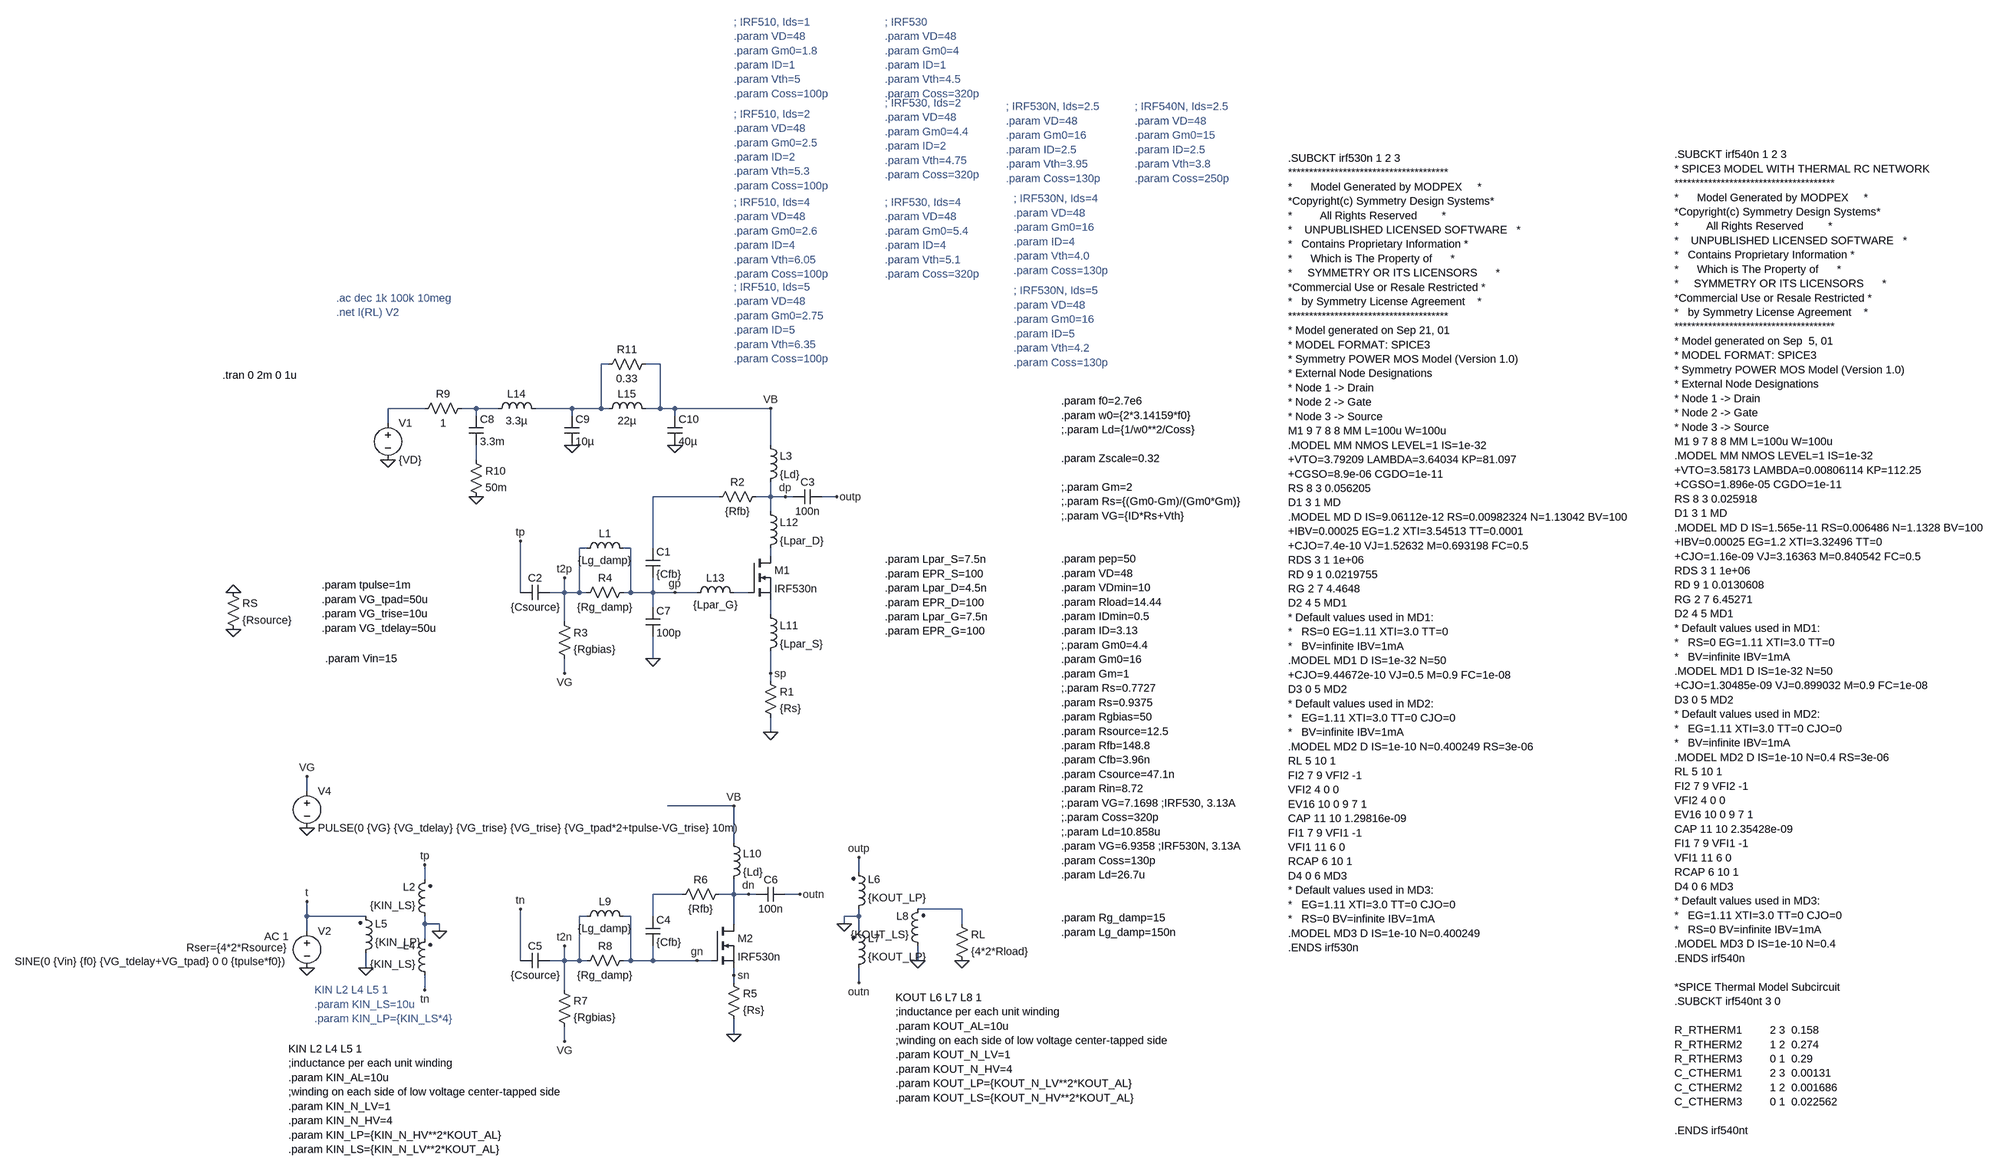
[diagram p0: schematic RFPA_tran_param.asc]
RFPA_tran_param.asc, the LTspice schematic file:
Version 4
SHEET 1 3240 1172
WIRE -80 -528 -96 -528
WIRE 32 -528 0 -528
WIRE -480 -432 -560 -432
WIRE -368 -432 -400 -432
WIRE -320 -432 -368 -432
WIRE -160 -432 -240 -432
WIRE -96 -432 -96 -528
WIRE -96 -432 -160 -432
WIRE -80 -432 -96 -432
WIRE 32 -432 32 -528
WIRE 32 -432 0 -432
WIRE 64 -432 32 -432
WIRE 272 -432 64 -432
WIRE -368 -416 -368 -432
WIRE -160 -416 -160 -432
WIRE 64 -416 64 -432
WIRE -560 -400 -560 -432
WIRE 272 -352 272 -432
WIRE -368 -320 -368 -352
WIRE 160 -240 16 -240
WIRE 272 -240 272 -272
WIRE 272 -240 240 -240
WIRE 304 -240 272 -240
WIRE 320 -240 304 -240
WIRE 416 -240 384 -240
WIRE 272 -208 272 -240
WIRE -128 -128 -144 -128
WIRE -32 -128 -48 -128
WIRE 16 -128 16 -240
WIRE 272 -112 272 -128
WIRE -272 -32 -272 -144
WIRE -176 -32 -176 -64
WIRE -176 -32 -208 -32
WIRE -144 -32 -144 -128
WIRE -144 -32 -176 -32
WIRE -128 -32 -144 -32
WIRE -32 -32 -32 -128
WIRE -32 -32 -48 -32
WIRE 16 -32 16 -64
WIRE 16 -32 -32 -32
WIRE 64 -32 16 -32
WIRE 112 -32 64 -32
WIRE 224 -32 192 -32
WIRE 16 0 16 -32
WIRE 272 16 272 -16
WIRE -176 32 -176 -32
WIRE 16 112 16 64
WIRE -176 144 -176 112
WIRE 272 144 272 96
WIRE 272 160 272 144
WIRE 272 272 272 240
WIRE -736 400 -736 368
WIRE 192 432 48 432
WIRE 192 512 192 432
WIRE 464 576 464 544
WIRE -480 592 -480 560
WIRE 80 624 16 624
WIRE 192 624 192 592
WIRE 192 624 160 624
WIRE 224 624 192 624
WIRE 240 624 224 624
WIRE 336 624 304 624
WIRE 688 656 592 656
WIRE -736 672 -736 640
WIRE -608 672 -736 672
WIRE -128 672 -144 672
WIRE -32 672 -48 672
WIRE 16 672 16 624
WIRE 464 672 464 656
WIRE 464 672 432 672
WIRE -480 688 -480 672
WIRE -448 688 -480 688
WIRE 192 688 192 624
WIRE 432 688 432 672
WIRE 688 688 688 656
WIRE -736 704 -736 672
WIRE -448 704 -448 688
WIRE 464 704 464 672
WIRE -480 720 -480 688
WIRE -272 768 -272 656
WIRE -176 768 -176 736
WIRE -176 768 -208 768
WIRE -144 768 -144 672
WIRE -144 768 -176 768
WIRE -128 768 -144 768
WIRE -32 768 -32 672
WIRE -32 768 -48 768
WIRE 16 768 16 736
WIRE 16 768 -32 768
WIRE 112 768 16 768
WIRE 144 768 112 768
WIRE 592 768 592 736
WIRE -608 784 -608 752
WIRE 192 800 192 784
WIRE 192 816 192 800
WIRE 464 816 464 784
WIRE -480 832 -480 800
WIRE -176 832 -176 768
WIRE 192 928 192 896
WIRE -176 944 -176 912
FLAG 272 272 0
FLAG -736 784 0
FLAG -736 480 0
FLAG -560 -320 0
FLAG 304 -240 dp
FLAG 64 -32 gp
FLAG 272 144 sp
FLAG -736 640 t
FLAG -896 48 0
FLAG -272 -144 tp
FLAG 688 768 0
FLAG -896 -32 0
FLAG -176 -64 t2p
FLAG 272 -432 VB
FLAG -736 368 VG
FLAG -176 144 VG
FLAG -608 784 0
FLAG -448 704 0
FLAG -480 560 tp
FLAG 592 768 0
FLAG 432 688 0
FLAG 416 -240 outp
FLAG 464 544 outp
FLAG 192 928 0
FLAG 224 624 dn
FLAG 112 768 gn
FLAG 192 800 sn
FLAG -272 656 tn
FLAG -176 736 t2n
FLAG 192 432 VB
FLAG -176 944 VG
FLAG 336 624 outn
FLAG 464 816 outn
FLAG -480 832 tn
FLAG 16 112 0
FLAG -368 -240 0
FLAG -160 -352 0
FLAG 64 -352 0
SYMBOL nmos 224 -112 R0
SYMATTR InstName M1
SYMATTR Value IRF530n
SYMATTR Prefix X
SYMBOL res 256 144 R0
SYMATTR InstName R1
SYMATTR Value {Rs}
SYMBOL res 256 -256 R90
WINDOW 0 0 56 VBottom 2
WINDOW 3 32 56 VTop 2
SYMATTR InstName R2
SYMATTR Value {Rfb}
SYMBOL cap 0 -128 R0
SYMATTR InstName C1
SYMATTR Value {Cfb}
SYMBOL res -192 16 R0
SYMATTR InstName R3
SYMATTR Value {Rgbias}
SYMBOL res -32 -48 R90
WINDOW 0 0 56 VBottom 2
WINDOW 3 32 56 VTop 2
SYMATTR InstName R4
SYMATTR Value {Rg_damp}
SYMBOL ind -144 -112 R270
WINDOW 0 32 56 VTop 2
WINDOW 3 5 56 VBottom 2
SYMATTR InstName L1
SYMATTR Value {Lg_damp}
SYMBOL cap -208 -48 R90
WINDOW 0 0 32 VBottom 2
WINDOW 3 32 32 VTop 2
SYMATTR InstName C2
SYMATTR Value {Csource}
SYMBOL voltage -560 -416 R0
WINDOW 123 0 0 Left 0
WINDOW 39 0 0 Left 0
SYMATTR InstName V1
SYMATTR Value {VD}
SYMBOL voltage -736 688 R0
WINDOW 3 -46 82 Right 2
WINDOW 123 -40 28 Right 2
WINDOW 39 -45 52 Right 2
SYMATTR Value SINE(0 {Vin} {f0} {VG_tdelay+VG_tpad} 0 0 {tpulse*f0})
SYMATTR Value2 AC 1
SYMATTR SpiceLine Rser={4*2*Rsource}
SYMATTR InstName V2
SYMBOL voltage -736 384 R0
WINDOW 123 0 0 Left 0
WINDOW 39 0 0 Left 0
SYMATTR InstName V4
SYMATTR Value PULSE(0 {VG} {VG_tdelay} {VG_trise} {VG_trise} {VG_tpad*2+tpulse-VG_trise} 10m)
SYMBOL res 672 672 R0
SYMATTR InstName RL
SYMATTR Value {4*2*Rload}
SYMBOL cap 384 -256 R90
WINDOW 0 0 32 VBottom 2
WINDOW 3 32 32 VTop 2
SYMATTR InstName C3
SYMATTR Value 100n
SYMBOL res -912 -48 R0
SYMATTR InstName RS
SYMATTR Value {Rsource}
SYMBOL ind 256 -368 R0
SYMATTR InstName L3
SYMATTR Value {Ld}
SYMBOL ind2 -464 688 R180
WINDOW 0 36 80 Left 2
WINDOW 3 36 40 Left 2
SYMATTR InstName L2
SYMATTR Value {KIN_LS}
SYMATTR Type ind
SYMBOL ind2 -464 816 R180
WINDOW 0 36 80 Left 2
WINDOW 3 36 40 Left 2
SYMATTR InstName L4
SYMATTR Value {KIN_LS}
SYMATTR Type ind
SYMBOL ind2 -624 768 M180
WINDOW 0 36 80 Left 2
WINDOW 3 36 40 Left 2
SYMATTR InstName L5
SYMATTR Value {KIN_LP}
SYMATTR Type ind
SYMATTR SpiceLine Rser=1m
SYMBOL ind2 448 672 M180
WINDOW 0 36 80 Left 2
WINDOW 3 36 40 Left 2
SYMATTR InstName L6
SYMATTR Value {KOUT_LP}
SYMATTR Type ind
SYMBOL ind2 448 800 M180
WINDOW 0 36 80 Left 2
WINDOW 3 36 40 Left 2
SYMATTR InstName L7
SYMATTR Value {KOUT_LP}
SYMATTR Type ind
SYMBOL ind2 608 752 R180
WINDOW 0 36 80 Left 2
WINDOW 3 36 40 Left 2
SYMATTR InstName L8
SYMATTR Value {KOUT_LS}
SYMATTR Type ind
SYMATTR SpiceLine Rser=1m
SYMBOL nmos 144 688 R0
SYMATTR InstName M2
SYMATTR Value IRF530n
SYMATTR Prefix X
SYMBOL res 176 800 R0
SYMATTR InstName R5
SYMATTR Value {Rs}
SYMBOL res 176 608 R90
WINDOW 0 0 56 VBottom 2
WINDOW 3 32 56 VTop 2
SYMATTR InstName R6
SYMATTR Value {Rfb}
SYMBOL cap 0 672 R0
SYMATTR InstName C4
SYMATTR Value {Cfb}
SYMBOL res -192 816 R0
SYMATTR InstName R7
SYMATTR Value {Rgbias}
SYMBOL res -32 752 R90
WINDOW 0 0 56 VBottom 2
WINDOW 3 32 56 VTop 2
SYMATTR InstName R8
SYMATTR Value {Rg_damp}
SYMBOL ind -144 688 R270
WINDOW 0 32 56 VTop 2
WINDOW 3 5 56 VBottom 2
SYMATTR InstName L9
SYMATTR Value {Lg_damp}
SYMBOL cap -208 752 R90
WINDOW 0 0 32 VBottom 2
WINDOW 3 32 32 VTop 2
SYMATTR InstName C5
SYMATTR Value {Csource}
SYMBOL cap 304 608 R90
WINDOW 0 0 32 VBottom 2
WINDOW 3 32 32 VTop 2
SYMATTR InstName C6
SYMATTR Value 100n
SYMBOL ind 176 496 R0
SYMATTR InstName L10
SYMATTR Value {Ld}
SYMBOL ind 256 0 R0
SYMATTR InstName L11
SYMATTR Value {Lpar_S}
SYMATTR SpiceLine Rpar={EPR_S}
SYMBOL ind 256 -224 R0
SYMATTR InstName L12
SYMATTR Value {Lpar_D}
SYMATTR SpiceLine Rpar={EPR_D}
SYMBOL ind 96 -16 R270
WINDOW 0 32 56 VTop 2
WINDOW 3 5 56 VBottom 2
SYMATTR InstName L13
SYMATTR Value {Lpar_G}
SYMATTR SpiceLine Rpar={EPR_G}
SYMBOL cap 0 0 R0
SYMATTR InstName C7
SYMATTR Value 100p
SYMBOL res -384 -448 R90
WINDOW 0 0 56 VBottom 2
WINDOW 3 32 56 VTop 2
SYMATTR InstName R9
SYMATTR Value 1
SYMBOL cap -384 -416 R0
SYMATTR InstName C8
SYMATTR Value 3.3m
SYMBOL res -384 -336 R0
SYMATTR InstName R10
SYMATTR Value 50m
SYMBOL ind -336 -416 R270
WINDOW 0 32 56 VTop 2
WINDOW 3 5 56 VBottom 2
SYMATTR InstName L14
SYMATTR Value 3.3µ
SYMBOL ind -96 -416 R270
WINDOW 0 32 56 VTop 2
WINDOW 3 5 56 VBottom 2
SYMATTR InstName L15
SYMATTR Value 22µ
SYMBOL cap -176 -416 R0
SYMATTR InstName C9
SYMATTR Value 10µ
SYMBOL cap 48 -416 R0
SYMATTR InstName C10
SYMATTR Value 40µ
SYMBOL res 16 -544 R90
WINDOW 0 0 56 VBottom 2
WINDOW 3 32 56 VTop 2
SYMATTR InstName R11
SYMATTR Value 0.33
TEXT 904 -448 Left 2 !.param f0=2.7e6\n.param w0={2*3.14159*f0}\n;.param Ld={1/w0**2/Coss}\n \n.param Zscale=0.32\n \n;.param Gm=2\n;.param Rs={(Gm0-Gm)/(Gm0*Gm)}\n;.param VG={ID*Rs+Vth}\n \n \n.param pep=50\n.param VD=48\n.param VDmin=10\n.param Rload=14.44\n.param IDmin=0.5\n.param ID=3.13\n;.param Gm0=4.4\n.param Gm0=16\n.param Gm=1\n;.param Rs=0.7727\n.param Rs=0.9375\n.param Rgbias=50\n.param Rsource=12.5\n.param Rfb=148.8\n.param Cfb=3.96n\n.param Csource=47.1n\n.param Rin=8.72\n;.param VG=7.1698 ;IRF530, 3.13A\n;.param Coss=320p\n;.param Ld=10.858u\n.param VG=6.9358 ;IRF530N, 3.13A\n.param Coss=130p\n.param Ld=26.7u\n \n \n.param Rg_damp=15\n.param Lg_damp=150n
TEXT -672 -672 Left 2 ;.ac dec 1k 100k 10meg\n.net I(RL) V2
TEXT 520 -1272 Left 2 ;; IRF530\n.param VD=48\n.param Gm0=4\n.param ID=1\n.param Vth=4.5\n.param Coss=320p
TEXT 192 -1272 Left 2 ;; IRF510, Ids=1\n.param VD=48\n.param Gm0=1.8\n.param ID=1\n.param Vth=5\n.param Coss=100p
TEXT 192 -1072 Left 2 ;; IRF510, Ids=2\n.param VD=48\n.param Gm0=2.5\n.param ID=2\n.param Vth=5.3\n.param Coss=100p
TEXT 192 -880 Left 2 ;; IRF510, Ids=4\n.param VD=48\n.param Gm0=2.6\n.param ID=4\n.param Vth=6.05\n.param Coss=100p
TEXT 192 -696 Left 2 ;; IRF510, Ids=5\n.param VD=48\n.param Gm0=2.75\n.param ID=5\n.param Vth=6.35\n.param Coss=100p
TEXT 520 -1096 Left 2 ;; IRF530, Ids=2\n.param VD=48\n.param Gm0=4.4\n.param ID=2\n.param Vth=4.75\n.param Coss=320p
TEXT 520 -880 Left 2 ;; IRF530, Ids=4\n.param VD=48\n.param Gm0=5.4\n.param ID=4\n.param Vth=5.1\n.param Coss=320p
TEXT 1680 -976 Left 2 !.SUBCKT irf530n 1 2 3\n**************************************\n*      Model Generated by MODPEX     *\n*Copyright(c) Symmetry Design Systems*\n*         All Rights Reserved        *\n*    UNPUBLISHED LICENSED SOFTWARE   *\n*   Contains Proprietary Information *\n*      Which is The Property of      *\n*     SYMMETRY OR ITS LICENSORS      *\n*Commercial Use or Resale Restricted *\n*   by Symmetry License Agreement    *\n**************************************\n* Model generated on Sep 21, 01\n* MODEL FORMAT: SPICE3\n* Symmetry POWER MOS Model (Version 1.0)\n* External Node Designations\n* Node 1 -> Drain\n* Node 2 -> Gate\n* Node 3 -> Source\nM1 9 7 8 8 MM L=100u W=100u\n.MODEL MM NMOS LEVEL=1 IS=1e-32\n+VTO=3.79209 LAMBDA=3.64034 KP=81.097\n+CGSO=8.9e-06 CGDO=1e-11\nRS 8 3 0.056205\nD1 3 1 MD\n.MODEL MD D IS=9.06112e-12 RS=0.00982324 N=1.13042 BV=100\n+IBV=0.00025 EG=1.2 XTI=3.54513 TT=0.0001\n+CJO=7.4e-10 VJ=1.52632 M=0.693198 FC=0.5\nRDS 3 1 1e+06\nRD 9 1 0.0219755\nRG 2 7 4.4648\nD2 4 5 MD1\n* Default values used in MD1:\n*   RS=0 EG=1.11 XTI=3.0 TT=0\n*   BV=infinite IBV=1mA\n.MODEL MD1 D IS=1e-32 N=50\n+CJO=9.44672e-10 VJ=0.5 M=0.9 FC=1e-08\nD3 0 5 MD2\n* Default values used in MD2:\n*   EG=1.11 XTI=3.0 TT=0 CJO=0\n*   BV=infinite IBV=1mA\n.MODEL MD2 D IS=1e-10 N=0.400249 RS=3e-06\nRL 5 10 1\nFI2 7 9 VFI2 -1\nVFI2 4 0 0\nEV16 10 0 9 7 1\nCAP 11 10 1.29816e-09\nFI1 7 9 VFI1 -1\nVFI1 11 6 0\nRCAP 6 10 1\nD4 0 6 MD3\n* Default values used in MD3:\n*   EG=1.11 XTI=3.0 TT=0 CJO=0\n*   RS=0 BV=infinite IBV=1mA\n.MODEL MD3 D IS=1e-10 N=0.400249\n.ENDS irf530n
TEXT 800 -888 Left 2 ;; IRF530N, Ids=4\n.param VD=48\n.param Gm0=16\n.param ID=4\n.param Vth=4.0\n.param Coss=130p
TEXT 800 -688 Left 2 ;; IRF530N, Ids=5\n.param VD=48\n.param Gm0=16\n.param ID=5\n.param Vth=4.2\n.param Coss=130p
TEXT 784 -1088 Left 2 ;; IRF530N, Ids=2.5\n.param VD=48\n.param Gm0=16\n.param ID=2.5\n.param Vth=3.95\n.param Coss=130p
TEXT 2520 -984 Left 2 !.SUBCKT irf540n 1 2 3\n* SPICE3 MODEL WITH THERMAL RC NETWORK\n**************************************\n*      Model Generated by MODPEX     *\n*Copyright(c) Symmetry Design Systems*\n*         All Rights Reserved        *\n*    UNPUBLISHED LICENSED SOFTWARE   *\n*   Contains Proprietary Information *\n*      Which is The Property of      *\n*     SYMMETRY OR ITS LICENSORS      *\n*Commercial Use or Resale Restricted *\n*   by Symmetry License Agreement    *\n**************************************\n* Model generated on Sep  5, 01\n* MODEL FORMAT: SPICE3\n* Symmetry POWER MOS Model (Version 1.0)\n* External Node Designations\n* Node 1 -> Drain\n* Node 2 -> Gate\n* Node 3 -> Source\nM1 9 7 8 8 MM L=100u W=100u\n.MODEL MM NMOS LEVEL=1 IS=1e-32\n+VTO=3.58173 LAMBDA=0.00806114 KP=112.25\n+CGSO=1.896e-05 CGDO=1e-11\nRS 8 3 0.025918\nD1 3 1 MD\n.MODEL MD D IS=1.565e-11 RS=0.006486 N=1.1328 BV=100\n+IBV=0.00025 EG=1.2 XTI=3.32496 TT=0\n+CJO=1.16e-09 VJ=3.16363 M=0.840542 FC=0.5\nRDS 3 1 1e+06\nRD 9 1 0.0130608\nRG 2 7 6.45271\nD2 4 5 MD1\n* Default values used in MD1:\n*   RS=0 EG=1.11 XTI=3.0 TT=0\n*   BV=infinite IBV=1mA\n.MODEL MD1 D IS=1e-32 N=50\n+CJO=1.30485e-09 VJ=0.899032 M=0.9 FC=1e-08\nD3 0 5 MD2\n* Default values used in MD2:\n*   EG=1.11 XTI=3.0 TT=0 CJO=0\n*   BV=infinite IBV=1mA\n.MODEL MD2 D IS=1e-10 N=0.4 RS=3e-06\nRL 5 10 1\nFI2 7 9 VFI2 -1\nVFI2 4 0 0\nEV16 10 0 9 7 1\nCAP 11 10 2.35428e-09\nFI1 7 9 VFI1 -1\nVFI1 11 6 0\nRCAP 6 10 1\nD4 0 6 MD3\n* Default values used in MD3:\n*   EG=1.11 XTI=3.0 TT=0 CJO=0\n*   RS=0 BV=infinite IBV=1mA\n.MODEL MD3 D IS=1e-10 N=0.4\n.ENDS irf540n\n \n*SPICE Thermal Model Subcircuit\n.SUBCKT irf540nt 3 0\n \nR_RTHERM1         2 3  0.158\nR_RTHERM2         1 2  0.274\nR_RTHERM3         0 1  0.29\nC_CTHERM1         2 3  0.00131\nC_CTHERM2         1 2  0.001686\nC_CTHERM3         0 1  0.022562\n \n.ENDS irf540nt
TEXT 1064 -1088 Left 2 ;; IRF540N, Ids=2.5\n.param VD=48\n.param Gm0=15\n.param ID=2.5\n.param Vth=3.8\n.param Coss=250p
TEXT -920 -504 Left 2 !.tran 0 2m 0 1u
TEXT -696 112 Left 2 !.param Vin=15
TEXT -720 832 Left 2 ;KIN L2 L4 L5 1\n.param KIN_LS=10u\n.param KIN_LP={KIN_LS*4}
TEXT 544 848 Left 2 !KOUT L6 L7 L8 1\n;inductance per each unit winding\n.param KOUT_AL=10u\n;winding on each side of low voltage center-tapped side\n.param KOUT_N_LV=1\n.param KOUT_N_HV=4\n.param KOUT_LP={KOUT_N_LV**2*KOUT_AL}\n.param KOUT_LS={KOUT_N_HV**2*KOUT_AL}
TEXT 520 -104 Left 2 !.param Lpar_S=7.5n\n.param EPR_S=100\n.param Lpar_D=4.5n\n.param EPR_D=100\n.param Lpar_G=7.5n\n.param EPR_G=100
TEXT -704 -48 Left 2 !.param tpulse=1m\n.param VG_tpad=50u\n.param VG_trise=10u\n.param VG_tdelay=50u
TEXT -776 960 Left 2 !KIN L2 L4 L5 1\n;inductance per each unit winding\n.param KIN_AL=10u\n;winding on each side of low voltage center-tapped side\n.param KIN_N_LV=1\n.param KIN_N_HV=4\n.param KIN_LP={KIN_N_HV**2*KOUT_AL}\n.param KIN_LS={KIN_N_LV**2*KOUT_AL}

The netlist it stands for:
* RFPA_tran_param.asc
XM1 N006 N007 N008 IRF530n  ; pins D G S
R1 sp 0 {Rs}
R2 dp N005 {Rfb}
C1 N005 gp {Cfb}
R3 t2p VG {Rgbias}
R4 gp t2p {Rg_damp}
L1 t2p gp {Lg_damp}
C2 t2p tp {Csource}
V1 N002 0 {VD}
V2 t 0 SINE(0 {Vin} {f0} {VG_tdelay+VG_tpad} 0 0 {tpulse*f0}) AC 1 Rser={4*2*Rsource}
V4 VG 0 PULSE(0 {VG} {VG_tdelay} {VG_trise} {VG_trise} {VG_tpad*2+tpulse-VG_trise} 10m)
RL N010 0 {4*2*Rload}
C3 outp dp 100n
RS 0 0 {Rsource}
L3 VB dp {Ld}
L2 0 tp {KIN_LS}
L4 tn 0 {KIN_LS}
L5 0 t {KIN_LP} Rser=1m
L6 0 outp {KOUT_LP}
L7 outn 0 {KOUT_LP}
L8 0 N010 {KOUT_LS} Rser=1m
XM2 dn gn sn IRF530n  ; pins D G S
R5 sn 0 {Rs}
R6 dn N009 {Rfb}
C4 N009 gn {Cfb}
R7 t2n VG {Rgbias}
R8 gn t2n {Rg_damp}
L9 t2n gn {Lg_damp}
C5 t2n tn {Csource}
C6 outn dn 100n
L10 VB dn {Ld}
L11 N008 sp {Lpar_S} Rpar={EPR_S}
L12 dp N006 {Lpar_D} Rpar={EPR_D}
L13 gp N007 {Lpar_G} Rpar={EPR_G}
C7 gp 0 100p
R9 N003 N002 1
C8 N003 N004 3.3m
R10 N004 0 50m
L14 N003 N001 3.3µ
L15 N001 VB 22µ
C9 N001 0 10µ
C10 VB 0 40µ
R11 VB N001 0.33
.param f0=2.7e6
.param w0={2*3.14159*f0}
;.param Ld={1/w0**2/Coss}
.param Zscale=0.32
;.param Gm=2
;.param Rs={(Gm0-Gm)/(Gm0*Gm)}
;.param VG={ID*Rs+Vth}
.param pep=50
.param VD=48
.param VDmin=10
.param Rload=14.44
.param IDmin=0.5
.param ID=3.13
;.param Gm0=4.4
.param Gm0=16
.param Gm=1
;.param Rs=0.7727
.param Rs=0.9375
.param Rgbias=50
.param Rsource=12.5
.param Rfb=148.8
.param Cfb=3.96n
.param Csource=47.1n
.param Rin=8.72
;.param VG=7.1698 ;IRF530, 3.13A
;.param Coss=320p
;.param Ld=10.858u
.param VG=6.9358 ;IRF530N, 3.13A
.param Coss=130p
.param Ld=26.7u
.param Rg_damp=15
.param Lg_damp=150n
* .ac dec 1k 100k 10meg
* .net I(RL) V2
* ; IRF530
* .param VD=48
* .param Gm0=4
* .param ID=1
* .param Vth=4.5
* .param Coss=320p
* ; IRF510, Ids=1
* .param VD=48
* .param Gm0=1.8
* .param ID=1
* .param Vth=5
* .param Coss=100p
* ; IRF510, Ids=2
* .param VD=48
* .param Gm0=2.5
* .param ID=2
* .param Vth=5.3
* .param Coss=100p
* ; IRF510, Ids=4
* .param VD=48
* .param Gm0=2.6
* .param ID=4
* .param Vth=6.05
* .param Coss=100p
* ; IRF510, Ids=5
* .param VD=48
* .param Gm0=2.75
* .param ID=5
* .param Vth=6.35
* .param Coss=100p
* ; IRF530, Ids=2
* .param VD=48
* .param Gm0=4.4
* .param ID=2
* .param Vth=4.75
* .param Coss=320p
* ; IRF530, Ids=4
* .param VD=48
* .param Gm0=5.4
* .param ID=4
* .param Vth=5.1
* .param Coss=320p
.SUBCKT irf530n 1 2 3
**************************************
*      Model Generated by MODPEX     *
*Copyright(c) Symmetry Design Systems*
*         All Rights Reserved        *
*    UNPUBLISHED LICENSED SOFTWARE   *
*   Contains Proprietary Information *
*      Which is The Property of      *
*     SYMMETRY OR ITS LICENSORS      *
*Commercial Use or Resale Restricted *
*   by Symmetry License Agreement    *
**************************************
* Model generated on Sep 21, 01
* MODEL FORMAT: SPICE3
* Symmetry POWER MOS Model (Version 1.0)
* External Node Designations
* Node 1 -> Drain
* Node 2 -> Gate
* Node 3 -> Source
M1 9 7 8 8 MM L=100u W=100u
.MODEL MM NMOS LEVEL=1 IS=1e-32
+VTO=3.79209 LAMBDA=3.64034 KP=81.097
+CGSO=8.9e-06 CGDO=1e-11
RS 8 3 0.056205
D1 3 1 MD
.MODEL MD D IS=9.06112e-12 RS=0.00982324 N=1.13042 BV=100
+IBV=0.00025 EG=1.2 XTI=3.54513 TT=0.0001
+CJO=7.4e-10 VJ=1.52632 M=0.693198 FC=0.5
RDS 3 1 1e+06
RD 9 1 0.0219755
RG 2 7 4.4648
D2 4 5 MD1
* Default values used in MD1:
*   RS=0 EG=1.11 XTI=3.0 TT=0
*   BV=infinite IBV=1mA
.MODEL MD1 D IS=1e-32 N=50
+CJO=9.44672e-10 VJ=0.5 M=0.9 FC=1e-08
D3 0 5 MD2
* Default values used in MD2:
*   EG=1.11 XTI=3.0 TT=0 CJO=0
*   BV=infinite IBV=1mA
.MODEL MD2 D IS=1e-10 N=0.400249 RS=3e-06
RL 5 10 1
FI2 7 9 VFI2 -1
VFI2 4 0 0
EV16 10 0 9 7 1
CAP 11 10 1.29816e-09
FI1 7 9 VFI1 -1
VFI1 11 6 0
RCAP 6 10 1
D4 0 6 MD3
* Default values used in MD3:
*   EG=1.11 XTI=3.0 TT=0 CJO=0
*   RS=0 BV=infinite IBV=1mA
.MODEL MD3 D IS=1e-10 N=0.400249
.ENDS irf530n
* ; IRF530N, Ids=4
* .param VD=48
* .param Gm0=16
* .param ID=4
* .param Vth=4.0
* .param Coss=130p
* ; IRF530N, Ids=5
* .param VD=48
* .param Gm0=16
* .param ID=5
* .param Vth=4.2
* .param Coss=130p
* ; IRF530N, Ids=2.5
* .param VD=48
* .param Gm0=16
* .param ID=2.5
* .param Vth=3.95
* .param Coss=130p
.SUBCKT irf540n 1 2 3
* SPICE3 MODEL WITH THERMAL RC NETWORK
**************************************
*      Model Generated by MODPEX     *
*Copyright(c) Symmetry Design Systems*
*         All Rights Reserved        *
*    UNPUBLISHED LICENSED SOFTWARE   *
*   Contains Proprietary Information *
*      Which is The Property of      *
*     SYMMETRY OR ITS LICENSORS      *
*Commercial Use or Resale Restricted *
*   by Symmetry License Agreement    *
**************************************
* Model generated on Sep  5, 01
* MODEL FORMAT: SPICE3
* Symmetry POWER MOS Model (Version 1.0)
* External Node Designations
* Node 1 -> Drain
* Node 2 -> Gate
* Node 3 -> Source
M1 9 7 8 8 MM L=100u W=100u
.MODEL MM NMOS LEVEL=1 IS=1e-32
+VTO=3.58173 LAMBDA=0.00806114 KP=112.25
+CGSO=1.896e-05 CGDO=1e-11
RS 8 3 0.025918
D1 3 1 MD
.MODEL MD D IS=1.565e-11 RS=0.006486 N=1.1328 BV=100
+IBV=0.00025 EG=1.2 XTI=3.32496 TT=0
+CJO=1.16e-09 VJ=3.16363 M=0.840542 FC=0.5
RDS 3 1 1e+06
RD 9 1 0.0130608
RG 2 7 6.45271
D2 4 5 MD1
* Default values used in MD1:
*   RS=0 EG=1.11 XTI=3.0 TT=0
*   BV=infinite IBV=1mA
.MODEL MD1 D IS=1e-32 N=50
+CJO=1.30485e-09 VJ=0.899032 M=0.9 FC=1e-08
D3 0 5 MD2
* Default values used in MD2:
*   EG=1.11 XTI=3.0 TT=0 CJO=0
*   BV=infinite IBV=1mA
.MODEL MD2 D IS=1e-10 N=0.4 RS=3e-06
RL 5 10 1
FI2 7 9 VFI2 -1
VFI2 4 0 0
EV16 10 0 9 7 1
CAP 11 10 2.35428e-09
FI1 7 9 VFI1 -1
VFI1 11 6 0
RCAP 6 10 1
D4 0 6 MD3
* Default values used in MD3:
*   EG=1.11 XTI=3.0 TT=0 CJO=0
*   RS=0 BV=infinite IBV=1mA
.MODEL MD3 D IS=1e-10 N=0.4
.ENDS irf540n
*SPICE Thermal Model Subcircuit
.SUBCKT irf540nt 3 0
R_RTHERM1         2 3  0.158
R_RTHERM2         1 2  0.274
R_RTHERM3         0 1  0.29
C_CTHERM1         2 3  0.00131
C_CTHERM2         1 2  0.001686
C_CTHERM3         0 1  0.022562
.ENDS irf540nt
* ; IRF540N, Ids=2.5
* .param VD=48
* .param Gm0=15
* .param ID=2.5
* .param Vth=3.8
* .param Coss=250p
.tran 0 2m 0 1u
.param Vin=15
* KIN L2 L4 L5 1
* .param KIN_LS=10u
* .param KIN_LP={KIN_LS*4}
KOUT L6 L7 L8 1
;inductance per each unit winding
.param KOUT_AL=10u
;winding on each side of low voltage center-tapped side
.param KOUT_N_LV=1
.param KOUT_N_HV=4
.param KOUT_LP={KOUT_N_LV**2*KOUT_AL}
.param KOUT_LS={KOUT_N_HV**2*KOUT_AL}
.param Lpar_S=7.5n
.param EPR_S=100
.param Lpar_D=4.5n
.param EPR_D=100
.param Lpar_G=7.5n
.param EPR_G=100
.param tpulse=1m
.param VG_tpad=50u
.param VG_trise=10u
.param VG_tdelay=50u
KIN L2 L4 L5 1
;inductance per each unit winding
.param KIN_AL=10u
;winding on each side of low voltage center-tapped side
.param KIN_N_LV=1
.param KIN_N_HV=4
.param KIN_LP={KIN_N_HV**2*KOUT_AL}
.param KIN_LS={KIN_N_LV**2*KOUT_AL}
.backanno
.end